# EAGLE design RAM (EAGLE 7.1.0)
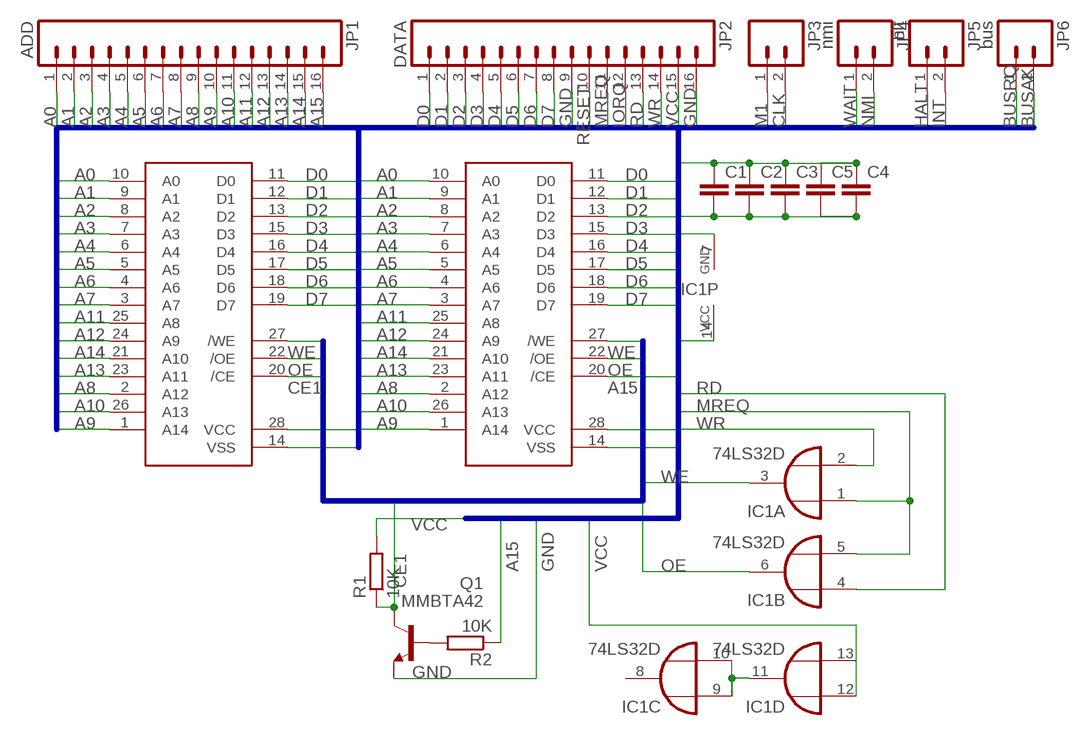
[diagram p0: schematic, sheet 1]

## Parts
C1  C-EUC0805  [C0805]
C2  C-EUC0805  [C0805]
C3  C-EUC0805  [C0805]
C4  C-EUC0805  [C0805]
C5  C-EUC0805  [C0805]
IC1  74LS32D  [SO14]
JP1  ADD  M16PTH  [1X16]
JP2  DATA  M16PTH  [1X16]
JP3  M02PTH  [1X02]
JP4  nmi  M02PTH  [1X02]
JP5  hlt  M02PTH  [1X02]
JP6  bus  M02PTH  [1X02]
Q1  MMBTA42  [SOT23]
R1  10K  R-EU_M0805  [M0805]
R2  10K  R-EU_M0805  [M0805]
U$1  AS7C256  [SOP28]
U$2  AS7C256  [SOP28]

## Nets
A0: JP1.1 U$1.10(A0) U$2.10(A0)
A1: JP1.2 U$1.9(A1) U$2.9(A1)
A2: JP1.3 U$1.8(A2) U$2.8(A2)
A3: JP1.4 U$1.7(A3) U$2.7(A3)
A4: JP1.5 U$1.6(A4) U$2.6(A4)
A5: JP1.6 U$1.5(A5) U$2.5(A5)
A6: JP1.7 U$1.4(A6) U$2.4(A6)
A7: JP1.8 U$1.3(A7) U$2.3(A7)
A8: JP1.9 U$1.2(A12) U$2.2(A12)
A9: JP1.10 U$1.1(A14) U$2.1(A14)
A10: JP1.11 U$1.26(A13) U$2.26(A13)
A11: JP1.12 U$1.25(A8) U$2.25(A8)
A12: JP1.13 U$1.24(A9) U$2.24(A9)
A13: JP1.14 U$1.23(A11) U$2.23(A11)
A14: JP1.15 U$1.21(A10) U$2.21(A10)
A15: JP1.16 R2.1 U$2.20(/CE)
BUSAK: JP6.2
BUSRQ: JP6.1
CE1: Q1.3(C) R1.1 U$1.20(/CE)
CLK: JP3.2
D0: JP2.1 U$1.11(D0) U$2.11(D0)
D1: JP2.2 U$1.12(D1) U$2.12(D1)
D2: JP2.3 U$1.13(D2) U$2.13(D2)
D3: JP2.4 U$1.15(D3) U$2.15(D3)
D4: JP2.5 U$1.16(D4) U$2.16(D4)
D5: JP2.6 U$1.17(D5) U$2.17(D5)
D6: JP2.7 U$1.18(D6) U$2.18(D6)
D7: JP2.8 U$1.19(D7) U$2.19(D7)
GND: C1.2 C2.2 C3.2 C4.2 C5.2 IC1.7(P:GND) JP2.9 JP2.16 Q1.2(E) U$1.14(VSS) U$2.14(VSS)
HALT: JP5.1
INT: JP5.2
IORQ: JP2.12
M1: JP3.1
MREQ: IC1.1(A:I0) IC1.5(B:I1) JP2.11
N$1: IC1.9(C:I0) IC1.10(C:I1) IC1.11(D:O)
N$2: Q1.1(B) R2.2
NMI: JP4.2
OE: IC1.6(B:O) U$1.22(/OE) U$2.22(/OE)
RD: IC1.4(B:I0) JP2.13
RESET: JP2.10
VCC: C1.1 C2.1 C3.1 C4.1 C5.1 IC1.12(D:I0) IC1.13(D:I1) IC1.14(P:VCC) JP2.15 R1.2 U$1.28(VCC) U$2.28(VCC)
WAIT: JP4.1
WE: IC1.3(A:O) U$1.27(/WE) U$2.27(/WE)
WR: IC1.2(A:I1) JP2.14
Unconnected: IC1.8(C:O)

## Buses
A0,A1,A2,A3,A4,A5,A6,A7,A8,A9,A10,A11,A12,A13,A14,A15,D0,D1,D2,D3,D4,D5,D6,D7,GND,VCC,WR,RD,IORQ,MREQ,RESET,M1,CLK,WAIT,NMI,HALT,INT,BUSRQ,BUSAK
CE1,WE,OE

## Library data of the parts
C1-C5 = rcl:C-EU: CAPACITOR, European symbol
IC1 = 74xx-eu:74*32: Quad 2-input OR gate
JP1 JP2 = SparkFun-Connectors:M16: 1x16 .1" header
JP3-JP6 = SparkFun:M02: Header 2 Standard 2-pin 0.1" header. Use with straight break away headers (SKU : PRT-00116), right angle break away headers (PRT-00553), swiss pins (PRT-00743), machine pins (PRT-00117), and female headers (PRT-00115). Molex polarized connector foot print use with SKU : PRT-08233 with associated crimp pins and housings.
Q1 = transistor-npn:MMBTA42: NPN TRANSISTOR
R1 R2 = rcl:R-EU_: RESISTOR, European symbol
U$1 U$2 = RalimTek:AS7C256

## Board
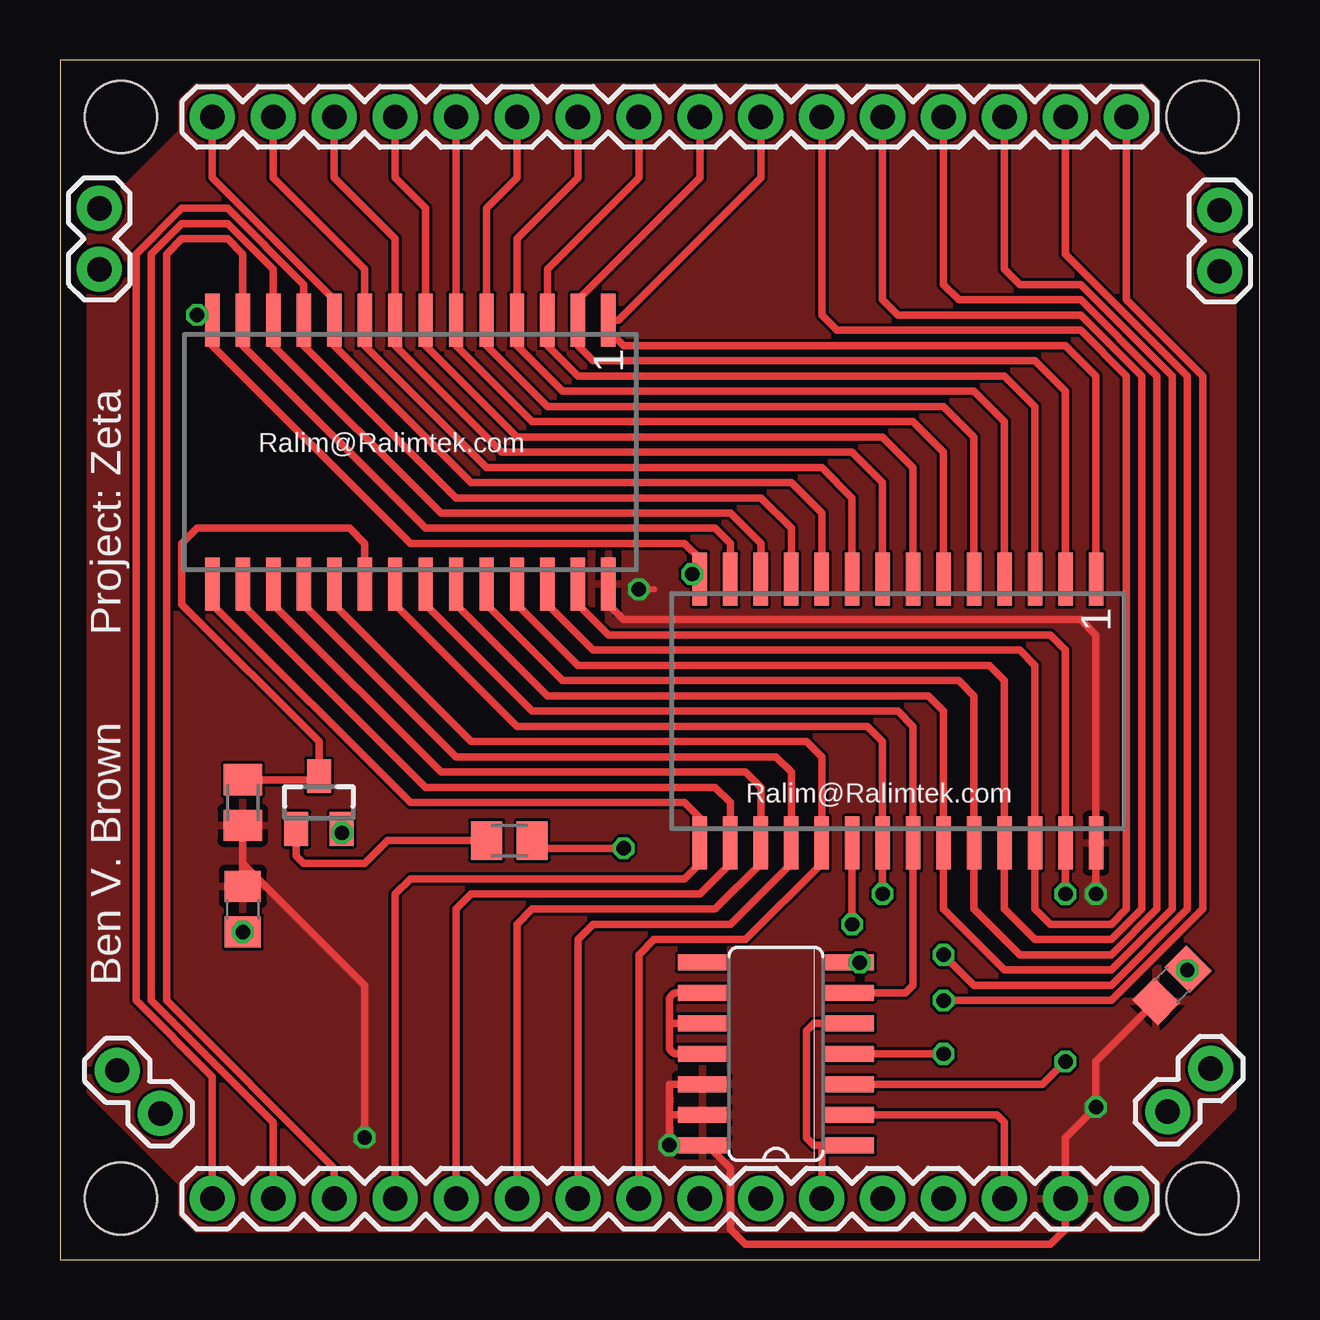
[diagram p1: board, top side]
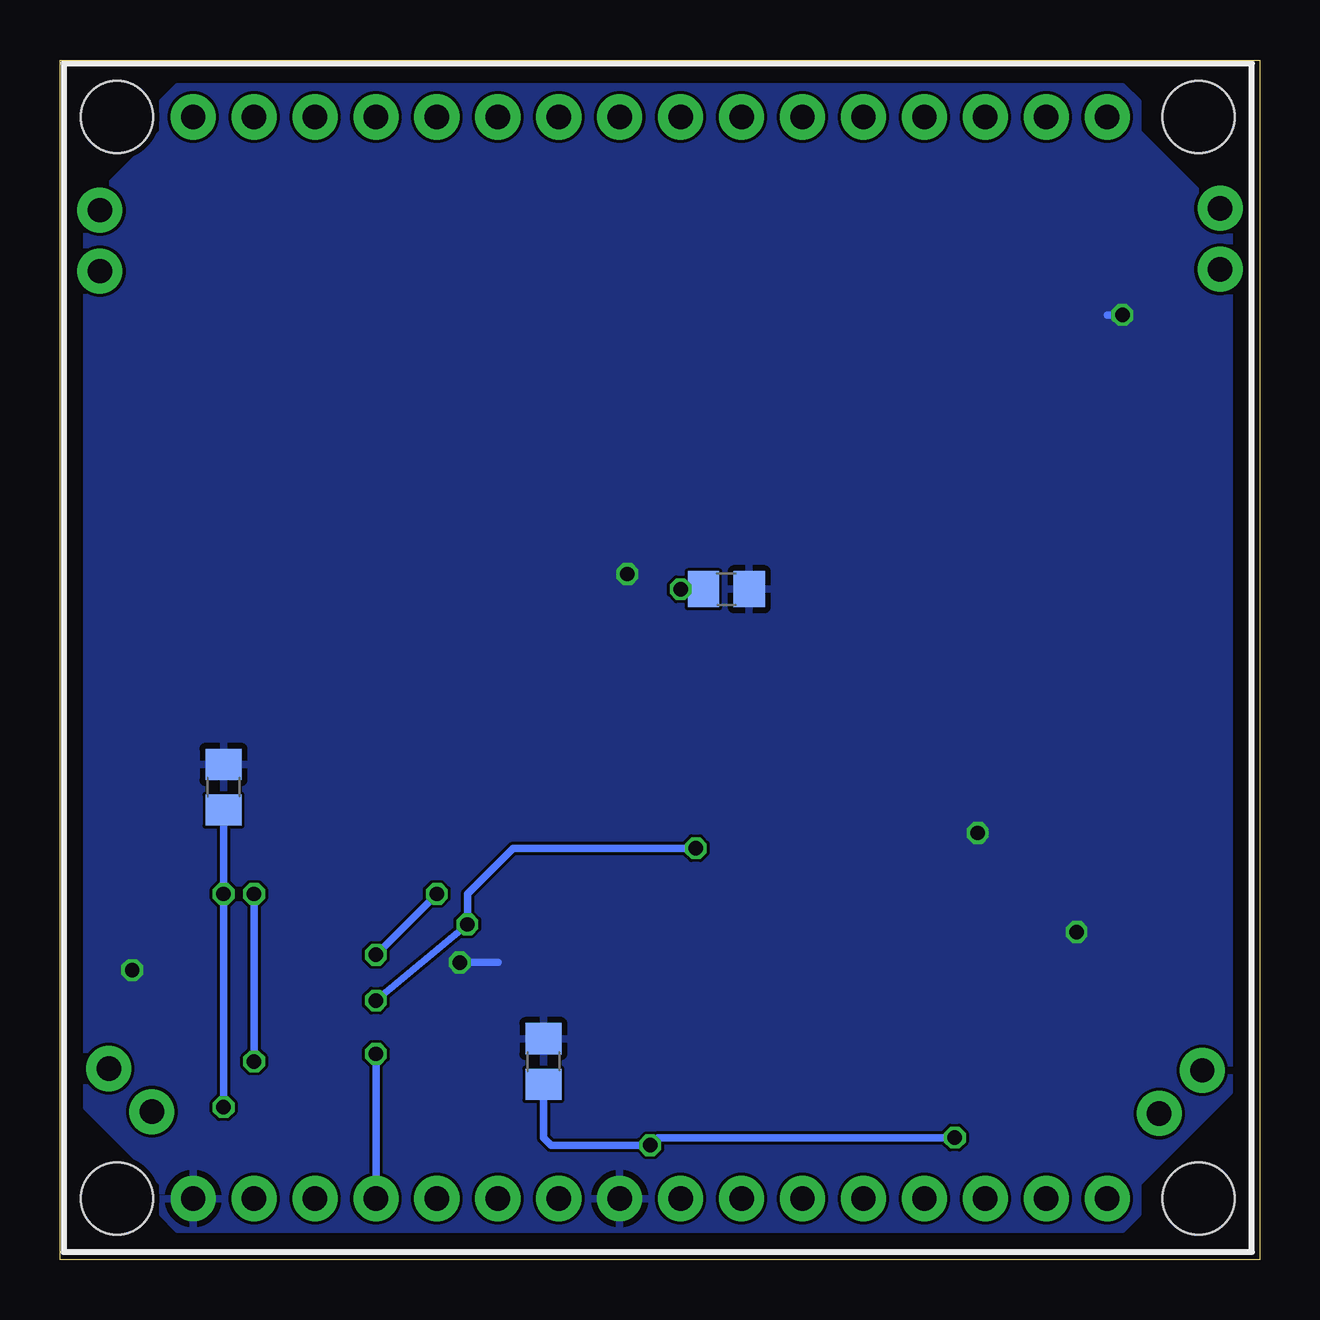
[diagram p2: board, bottom side, seen from below]

Size 50 x 50 mm. Coordinates in mm from the lower left corner, seen from the top.
Outline: 0,0 50,0 50,50 0,50 0,0
Copper layers (1*16): Top 0.035mm / dielectric 1.5mm / Bottom 0.035mm
Design rules "dirt_cheap_dirty_boards.v1": minimum track width 5mil, minimum drill 12mil, track to track 5mil, track to pad 5mil, pad to pad 5mil, via to via 5mil, smd to smd 0mil, copper to edge 10mil, drill to drill 10mil, minimum pad ring 10mil, minimum via ring 6mil, stop-mask expansion 2mil, vias tented up to drill 25mil, thermal gap 10mil
Holes 3 mm at 2.54,47.62 47.62,47.62 47.62,2.54 2.54,2.54

### Footprints (pad centres in the part's own frame; a part is rotated, then mirrored left to right if it is on the bottom)
C0805 = smd 1.3 x 1.5: 1 -0.95,0; 2 0.95,0
SO14 = smd 0.66 x 2.032: 1 -3.81,-3.073; 2 -2.54,-3.073; 3 -1.27,-3.073; 4 0,-3.073; 5 1.27,-3.073; 6 2.54,-3.073; 7 3.81,-3.073; 8 3.81,3.073; 9 2.54,3.073; 10 1.27,3.073; 11 0,3.073; 12 -1.27,3.073; 13 -2.54,3.073; 14 -3.81,3.073
1X16 = drill 1.016 pad 1.88: 1 0,0; 2 2.54,0; 3 5.08,0; 4 7.62,0; 5 10.16,0; 6 12.7,0; 7 15.24,0; 8 17.78,0; 9 20.32,0; 10 22.86,0; 11 25.4,0; 12 27.94,0; 13 30.48,0; 14 33.02,0; 15 35.56,0; 16 38.1,0
1X02 = drill 1.016 pad 1.88: 1 0,0; 2 2.54,0
SOT23 = smd 1 x 1.4: 1 -0.95,-1.1; 2 0.95,-1.1; 3 0,1.1
M0805 = smd 1.3 x 1.6: 1 -0.95,0; 2 0.95,0
SOP28 = smd 0.6 x 2.2: 1 -8.255,-5.5; 2 -6.985,-5.5; 3 -5.715,-5.5; 4 -4.445,-5.5; 5 -3.175,-5.5; 6 -1.905,-5.5; 7 -0.635,-5.5; 8 0.635,-5.5; 9 1.905,-5.5; 10 3.175,-5.5; 11 4.445,-5.5; 12 5.715,-5.5; 13 6.985,-5.5; 14 8.255,-5.5; 15 8.255,5.5; 16 6.985,5.5; 17 5.715,5.5; 18 4.445,5.5; 19 3.175,5.5; 20 1.905,5.5; 21 0.635,5.5; 22 -0.635,5.5; 23 -1.905,5.5; 24 -3.175,5.5; 25 -4.445,5.5; 26 -5.715,5.5; 27 -6.985,5.5; 28 -8.255,5.5

### Placement (x,y rotation side)
C1  7.62,14.61 270 top
C2  46.35,11.43 45 top
C3  43.18,19.68 90 bottom
C4  29.84,8.26 90 bottom
C5  22.23,27.94 0 bottom
IC1  29.84,8.57 90 top
JP1  6.35,47.62 0 top
JP2  6.35,2.54 0 top
JP3  4.18,6.09 135 top
JP4  46.17,6.16 45 top
JP5  1.64,41.27 90 top
JP6  48.34,41.2 90 top
Q1  10.79,19.05 0 top
R1  7.62,19.05 270 top
R2  18.73,17.46 180 top
U$1  14.61,33.66 180 top
U$2  34.92,22.86 180 top

### Tracks (layer width: path | path; a pad name or v marks a point on that pad's centre or on a via)
A0
  Top 0.305: U$2.10 31.75,31.11 30.48,32.38 17.14,32.38 11.43,38.1 U$1.10 11.43,40.01 6.35,45.09 JP1.1
A1
  Top 0.305: U$2.9 33.02,31.75 31.75,33.02 17.78,33.02 12.7,38.1 U$1.9 12.7,41.27 8.89,45.09 JP1.2
A2
  Top 0.305: U$2.8 34.29,32.38 33.02,33.66 18.41,33.66 13.97,38.1 U$1.8 13.97,42.55 11.43,45.09 JP1.3
A3
  Top 0.305: U$2.7 35.56,33.02 34.29,34.29 19.05,34.29 15.24,38.1 U$1.7 15.24,43.81 13.97,45.09 JP1.4
A4
  Top 0.305: U$2.6 36.83,33.66 35.56,34.92 19.68,34.92 16.51,38.1 U$1.6 JP1.5
A5
  Top 0.305: U$2.5 38.1,34.29 36.83,35.56 20.32,35.56 17.78,38.1 U$1.5 17.78,43.81 19.05,45.09 JP1.6
A6
  Top 0.305: U$2.4 39.37,34.92 38.1,36.2 20.95,36.2 19.05,38.1 U$1.4 19.05,42.55 21.59,45.09 JP1.7
A7
  Top 0.305: U$2.3 40.64,35.56 39.37,36.83 21.59,36.83 20.32,38.1 U$1.3 20.32,41.27 24.13,45.09 JP1.8
A8
  Top 0.305: JP1.9 26.67,45.09 21.59,40.01 U$1.2 21.59,38.1 22.23,37.47 40.64,37.47 41.91,36.2 U$2.2
A9
  Top 0.305: U$2.1 43.18,36.83 41.91,38.1 23.5,38.1 22.86,38.73 U$1.1 23.28,39.16 29.21,45.09 JP1.10
A10
  Top 0.305: U$1.26 20.32,27.3 22.23,25.4 40.01,25.4 40.64,24.77 U$2.26 40.64,14.61 41.27,13.97 43.81,13.97 44.45,14.61 44.45,36.83 42.55,38.73 32.38,38.73 31.75,39.37 JP1.11
A11
  Top 0.305: U$1.25 19.05,27.3 21.59,24.77 38.73,24.77 39.37,24.13 U$2.25 39.37,14.61 40.64,13.34 43.81,13.34 45.09,14.61 45.09,36.83 42.55,39.37 34.92,39.37 34.29,40.01 JP1.12
A12
  Top 0.305: U$1.24 17.78,27.3 20.95,24.13 37.47,24.13 38.1,23.5 U$2.24 38.1,14.61 40.01,12.7 43.81,12.7 45.72,14.61 45.72,36.83 42.55,40.01 37.47,40.01 36.83,40.64 JP1.13
A13
  Top 0.305: U$1.23 16.51,27.3 20.32,23.5 36.2,23.5 36.83,22.86 U$2.23 36.83,14.61 39.37,12.06 43.81,12.06 46.35,14.61 46.35,36.83 42.55,40.64 40.01,40.64 39.37,41.27 JP1.14
A14  (via drill 0.6)
  Top 0.305: U$1.21 13.97,27.3 19.05,22.23 33.66,22.23 34.29,21.59 U$2.21 v34.29,15.24 | JP1.15 41.91,41.91 46.99,36.83 46.99,14.61 43.81,11.43 38.1,11.43 v36.83,12.7
  Bottom 0.305: v36.83,12.7 v34.29,15.24
A15  (via drill 0.6)
  Top 0.305: JP1.16 44.45,40.01 47.62,36.83 47.62,14.61 43.81,10.79 v36.83,10.79 | v33.02,13.97 U$2.20 | R2.1 arc90 20,17.14 v23.5,17.14
  Bottom 0.305: v36.83,10.79 v33.02,13.97 33.02,15.24 31.11,17.14 v23.5,17.14
CE1
  Top 0.305: U$1.20 12.7,29.84 12.06,30.48 5.71,30.48 5.08,29.84 5.08,27.3 10.79,21.59 Q1.3 10.64,20 R1.1
D0
  Top 0.305: U$2.11 30.48,30.48 29.21,31.75 16.51,31.75 10.16,38.1 U$1.11 10.16,40.64 6.99,43.81 5.08,43.81 3.17,41.91 3.17,10.79 6.35,7.62 JP2.1
D1
  Top 0.305: U$2.12 29.21,29.84 27.94,31.11 15.88,31.11 8.89,38.1 U$1.12 8.89,41.27 6.99,43.18 5.08,43.18 3.81,41.91 3.81,10.79 8.89,5.71 JP2.2
D2
  Top 0.305: U$2.13 27.94,29.84 27.3,30.48 15.24,30.48 7.62,38.1 U$1.13 7.62,41.91 6.99,42.55 5.08,42.55 4.45,41.91 4.45,10.79 11.43,3.81 JP2.3
D3
  Top 0.305: U$1.15 6.35,27.3 14.61,19.05 26.04,19.05 26.67,18.41 U$2.15 26.67,16.51 26.04,15.88 14.61,15.88 13.97,15.24 JP2.4
D4
  Top 0.305: U$1.16 7.62,27.3 15.24,19.68 27.3,19.68 27.94,19.05 U$2.16 27.94,16.51 26.67,15.24 17.14,15.24 16.51,14.61 JP2.5
D5
  Top 0.305: U$1.17 8.89,27.3 15.88,20.32 28.57,20.32 29.21,19.68 U$2.17 29.21,16.51 27.3,14.61 19.68,14.61 19.05,13.97 JP2.6
D6
  Top 0.305: U$1.18 10.16,27.3 16.51,20.95 29.84,20.95 30.48,20.32 U$2.18 30.48,16.51 27.94,13.97 22.23,13.97 21.59,13.34 JP2.7
D7
  Top 0.305: U$1.19 11.43,27.3 17.14,21.59 31.11,21.59 31.75,20.95 U$2.19 31.75,16.51 28.57,13.34 24.77,13.34 24.13,12.7 JP2.8
GND  (via drill 0.6)
  Top 0.305: v26.35,28.57 26.45,28.57 U$2.14 26.67,29.21 26.04,29.84 14.61,29.84 6.35,38.1 U$1.14 6.35,39.37 v5.71,39.37 | Q1.2 11.91,17.78 v11.75,17.78 | v7.62,13.65 | IC1.7 v33.34,12.38 | C2.2 v46.99,12.06
  Bottom 0.305: v26.35,28.57 26.67,28.57 | v5.71,39.37 6.35,39.37 | v33.34,12.38 31.75,12.38
  pour Bottom: 1.27,6.99 5.08,3.17 5.08,1.91 5.71,1.27 45.09,1.27 45.72,1.91 45.72,3.17 48.9,6.35 48.9,43.81 45.72,46.99 45.72,48.26 45.09,48.9 5.71,48.9 5.08,48.26 5.08,46.99 1.27,43.18
MREQ
  Top 0.305: IC1.5 31.43,9.84 31.11,9.53 31.11,5.08 31.43,4.76 31.75,4.76 | IC1.1 31.75,4.76 | JP2.11 31.75,4.76
N$1
  Top 0.305: IC1.11 25.72,8.57 arc-90 25.4,8.89 25.4,9.84 | IC1.9 25.72,11.11 arc90 25.4,10.79 25.4,10.16 25.4,9.84 | IC1.10 25.4,9.84
N$2
  Top 0.305: Q1.1 9.85,16.82 10.16,16.51 12.7,16.51 13.65,17.46 R2.2
OE
  Top 0.305: U$1.22 15.24,27.3 19.68,22.86 34.92,22.86 35.56,22.23 U$2.22 35.56,11.43 35.24,11.11 IC1.6
RD  (via drill 0.6)
  Top 0.305: IC1.4 v36.83,8.57
  Bottom 0.305: v36.83,8.57 JP2.13
VCC  (via drill 0.6)
  Top 0.254: v24.13,27.94 24.77,27.94
  Top 0.305: U$1.28 22.86,27.3 23.5,26.67 42.55,26.67 43.18,26.04 U$2.28 v43.18,15.24 | R1.2 7.62,16.51 | 7.62,16.51 12.7,11.43 v12.7,5.08 | C2.1 43.18,8.26 v43.18,6.35 41.91,5.08 JP2.15 41.91,1.27 41.27,0.64 28.57,0.64 27.94,1.27 27.94,3.81 26.99,4.76 IC1.14 v25.4,4.76 25.4,6.03 | C1.1 7.62,16.51 | IC1.12 25.4,7.3 25.4,6.03 | IC1.13 25.4,6.03
  Bottom 0.254: C5.1 v24.13,27.94
  Bottom 0.305: v43.18,6.35 v43.18,15.24 C3.1 | v12.7,5.08 25.08,5.08 v25.4,4.76 29.53,4.76 29.84,5.08 C4.1
  pour Top: 1.27,6.99 5.08,3.17 5.08,1.91 5.71,1.27 45.09,1.27 45.72,1.91 45.72,3.17 48.9,6.35 48.9,43.81 45.72,46.99 45.72,48.26 45.09,48.9 5.71,48.9 5.08,48.26 5.08,46.99 1.27,43.18
WE  (via drill 0.6)
  Top 0.305: U$1.27 21.59,27.3 22.86,26.04 41.27,26.04 41.91,25.4 U$2.27 v41.91,15.24 | IC1.3 40.96,7.3 v41.91,8.26
  Bottom 0.305: v41.91,8.26 v41.91,15.24
WR
  Top 0.305: IC1.2 39.05,6.03 39.37,5.71 JP2.14

### Text on the board
tPlace: Ralim@Ralimtek.com | Project: Zeta | Ralim@Ralimtek.com | Ben V. Brown